# EAGLE schematic ubalancev0 (EAGLE 7.1.0)
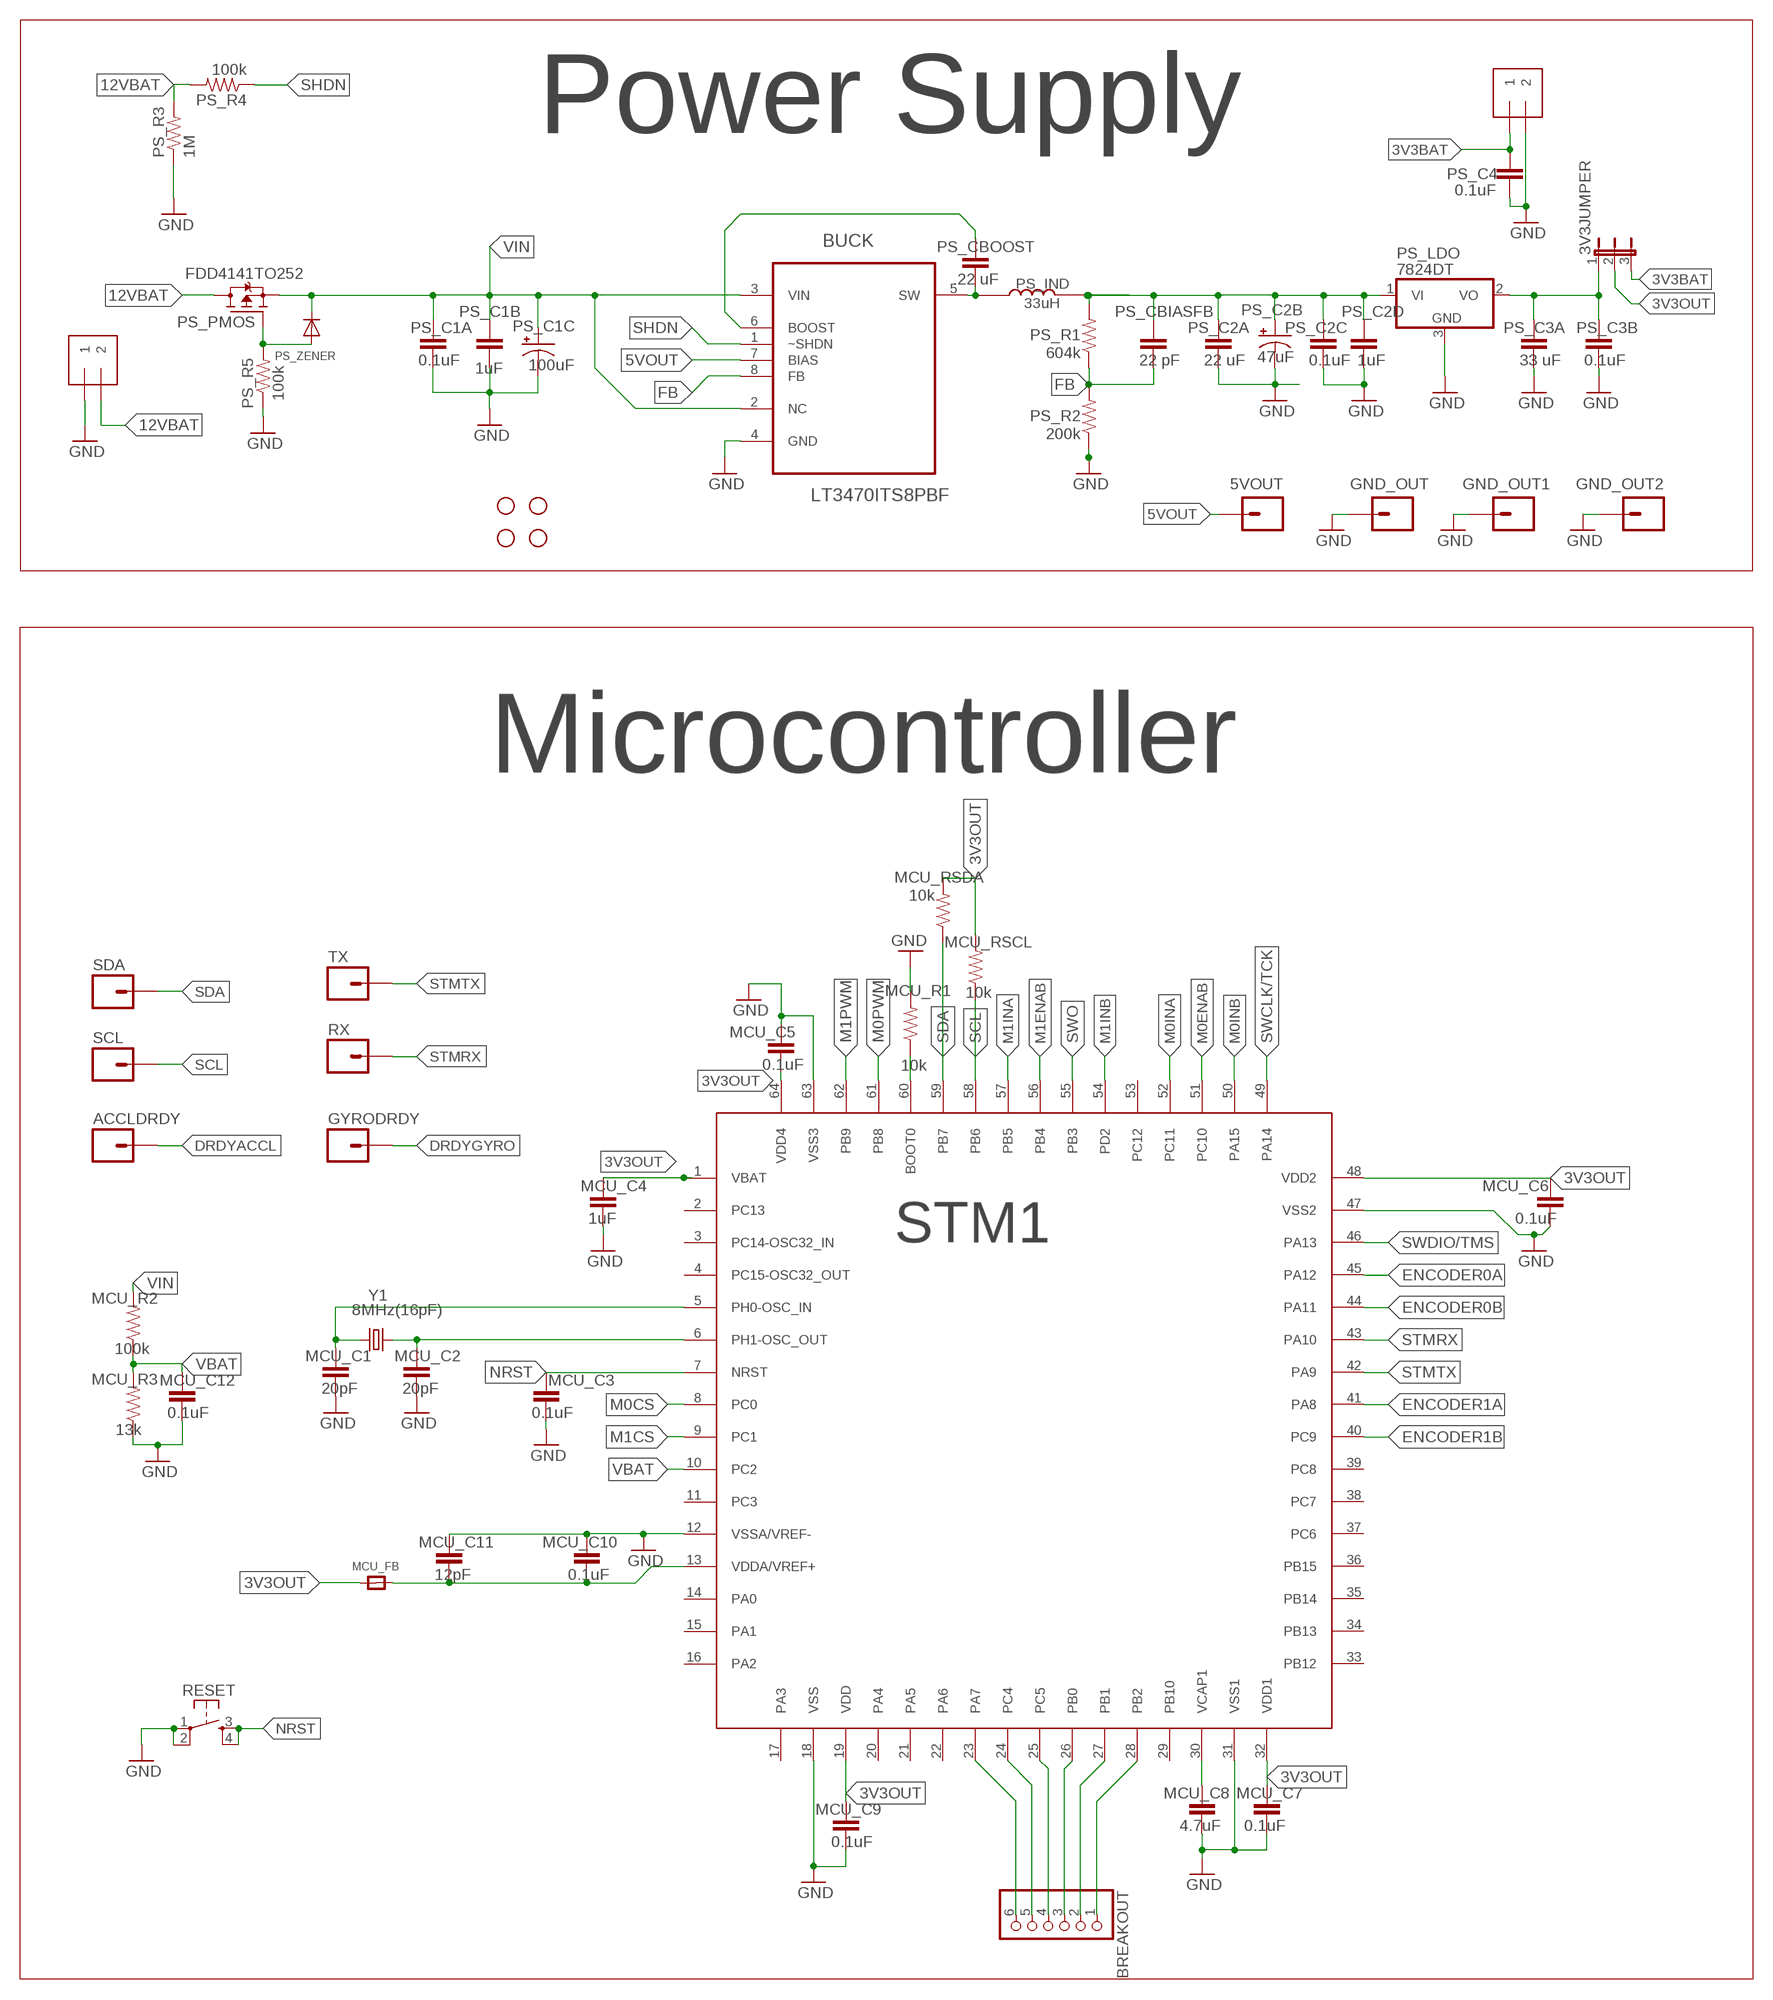
[diagram p0: schematic, sheet 1, part 1 of 2]
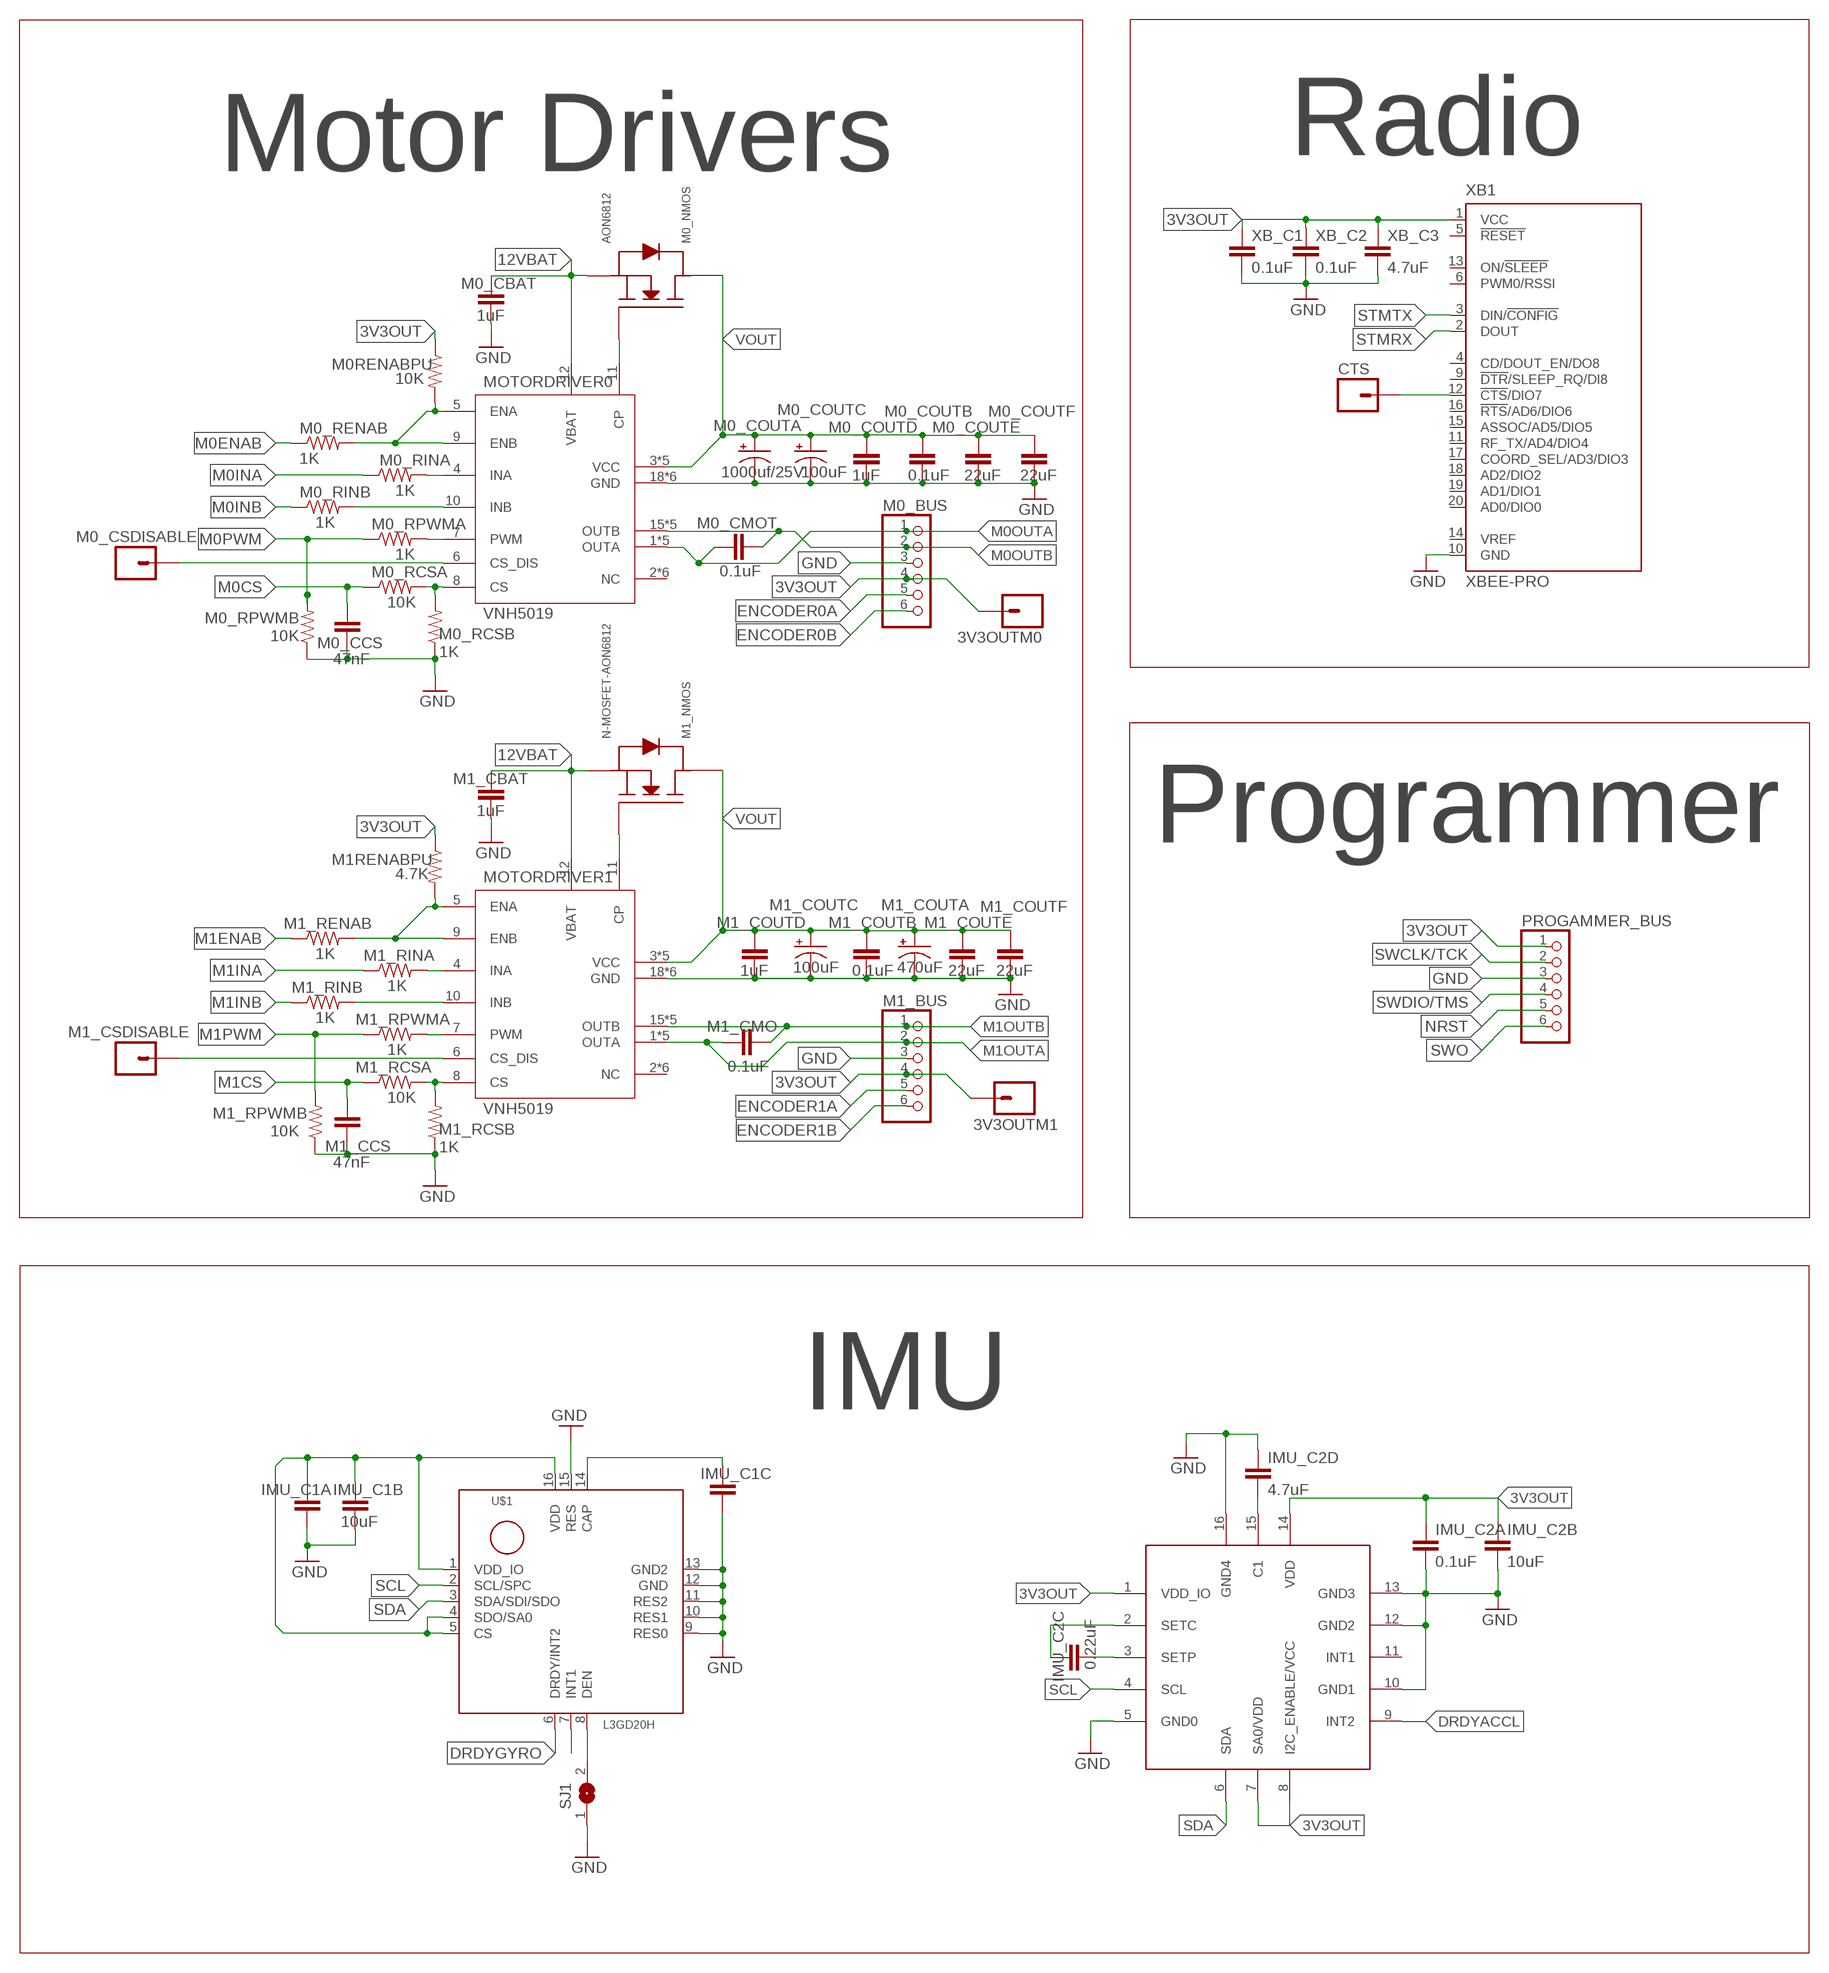
[diagram p1: schematic, sheet 1, part 2 of 2]

## Parts
3V3JUMPER  JUMPER3  [JUMPER3]
3V3OUTM0  M01PTH  [1X01]
3V3OUTM1  M01PTH  [1X01]
5VOUT  M01PTH  [1X01]
ACCLDRDY  M01PTH  [1X01]
BREAKOUT  PINHD-1X6LOCK  [1X06-BIGLOCK]
BUCK  LT3470ITS8PBF  [SOT65P280X100-8N]
CTS  M01PTH  [1X01]
GND_OUT  M01PTH  [1X01]
GND_OUT1  M01PTH  [1X01]
GND_OUT2  M01PTH  [1X01]
GYRODRDY  M01PTH  [1X01]
IMU_C1A  0.1uF  CAP0805  [0805]
IMU_C1B  10uF  CAP0805  [0805]
IMU_C1C  10nF  CAP0805  [0805]
IMU_C2A  0.1uF  CAP0805  [0805]
IMU_C2B  10uF  CAP0805  [0805]
IMU_C2C  0.22uF  CAP0805  [0805]
IMU_C2D  4.7uF  CAP0805  [0805]
M0_BUS  PINHD-1X6LOCK  [1X06-BIGLOCK]
M0_CBAT  1uF  CAP0805  [0805]
M0_CCS  47nF  CAP0805  [0805]
M0_CMOT  0.1uF  CAP0805  [0805]
M0_COUTA  1000uf/25V  1000UF-25V(PTH)KIT  [CPOL-RADIAL-1000UF-25V-KIT]
M0_COUTB  0.1uF  CAP0805  [0805]
M0_COUTC  100uF  CAP_POLD  [PANASONIC_D]
M0_COUTD  1uF  CAP0805  [0805]
M0_COUTE  22uF  CAP1206  [1206]
M0_COUTF  22uF  CAP0805  [0805]
M0_CSDISABLE  M01PTH  [1X01]
M0_NMOS  AON6812  N-MOSFET-AON6812  [8DFN-5*6MM]
M0_RCSA  10K  RESISTOR0805-RES  [0805]
M0_RCSB  1K  RESISTOR0805-RES  [0805]
M0_RENAB  1K  RESISTOR0805-RES  [0805]
M0_RINA  1K  RESISTOR0805-RES  [0805]
M0_RINB  1K  RESISTOR0805-RES  [0805]
M0_RPWMA  1K  RESISTOR0805-RES  [0805]
M0_RPWMB  10K  RESISTOR0805-RES  [0805]
M0RENABPU  10K  RESISTOR0805-RES  [0805]
M1_BUS  PINHD-1X6LOCK  [1X06-BIGLOCK]
M1_CBAT  1uF  CAP0805  [0805]
M1_CCS  47nF  CAP0805  [0805]
M1_CMO  0.1uF  CAP0805  [0805]
M1_COUTA  470uF  CPOL-USG  [PANASONIC_G]
M1_COUTB  0.1uF  CAP0805  [0805]
M1_COUTC  100uF  CAP_POLD  [PANASONIC_D]
M1_COUTD  1uF  CAP0805  [0805]
M1_COUTE  22uF  CAP1206  [1206]
M1_COUTF  22uF  CAP1206  [1206]
M1_CSDISABLE  M01PTH  [1X01]
M1_NMOS  N-MOSFET-AON6812  [8DFN-5*6MM]
M1_RCSA  10K  RESISTOR0805-RES  [0805]
M1_RCSB  1K  RESISTOR0805-RES  [0805]
M1_RENAB  1K  RESISTOR0805-RES  [0805]
M1_RINA  1K  RESISTOR0805-RES  [0805]
M1_RINB  1K  RESISTOR0805-RES  [0805]
M1_RPWMA  1K  RESISTOR0805-RES  [0805]
M1_RPWMB  10K  RESISTOR0805-RES  [0805]
M1RENABPU  4.7K  RESISTOR0805-RES  [0805]
MCU_C1  20pF  CAP0805  [0805]
MCU_C2  20pF  CAP0805  [0805]
MCU_C3  0.1uF  CAP0805  [0805]
MCU_C4  1uF  CAP0805  [0805]
MCU_C5  0.1uF  CAP0805  [0805]
MCU_C6  0.1uF  CAP0805  [0805]
MCU_C7  0.1uF  CAP0805  [0805]
MCU_C8  4.7uF  CAP0805  [0805]
MCU_C9  0.1uF  CAP0805  [0805]
MCU_C10  0.1uF  CAP0805  [0805]
MCU_C11  12pF  CAP0805  [0805]
MCU_C12  0.1uF  CAP0805  [0805]
MCU_FB  FERRITE  [0603]
MCU_R1  10k  RESISTOR0805-RES  [0805]
MCU_R2  100k  RESISTOR0805-RES  [0805]
MCU_R3  13k  RESISTOR0805-RES  [0805]
MCU_RSCL  10k  RESISTOR0805-RES  [0805]
MCU_RSDA  10k  RESISTOR0805-RES  [0805]
MOTORDRIVER0  VNH5019  [MULTIPOWERSO-30]
MOTORDRIVER1  VNH5019  [MULTIPOWERSO-30]
PROGAMMER_BUS  PINHD-1X6LOCK  [1X06-BIGLOCK]
PS_3V3TERM  1X2-3.5MM  [1X2-3.5MM]
PS_12VTERM  1X2-3.5MM  [1X2-3.5MM]
PS_C1A  0.1uF  CAP0805  [0805]
PS_C1B  1uF  CAP0805  [0805]
PS_C1C  100uF  CAP_POLD  [PANASONIC_D]
PS_C2A  22 uF  CAP1206  [1206]
PS_C2B  47uF  CAP_POLD  [PANASONIC_D]
PS_C2C  0.1uF  CAP0805  [0805]
PS_C2D  1uF  CAP0805  [0805]
PS_C3A  33 uF  CAP1206  [1206]
PS_C3B  0.1uF  CAP0805  [0805]
PS_C4  0.1uF  CAP0805  [0805]
PS_CBIASFB  22 pF  CAP0805  [0805]
PS_CBOOST  .22 uF  CAP0402-CAP  [0402-CAP]
PS_IND  33uH  SMDINDUCTOR  [VLCF5024]
PS_LDO  7824DT  [TO252]
PS_PMOS  FDD4141TO252  [TO252]
PS_R1  604k  RESISTOR0805-RES  [0805]
PS_R2  200k  RESISTOR0805-RES  [0805]
PS_R3  1M  RESISTOR0805-RES  [0805]
PS_R4  100k  RESISTOR0805-RES  [0805]
PS_R5  100k  RESISTOR0805-RES  [0805]
PS_ZENER  DIODESOD-123  [SOD-123]
RESET  TAC_SWITCHPTH  [TACTILE-PTH]
RX  M01PTH  [1X01]
SCL  M01PTH  [1X01]
SDA  M01PTH  [1X01]
SJ1  SOLDERJUMPER  [SOLDERJUMPER_ARROW_NOPASTE]
STANDOFF1  STAND-OFF  [STAND-OFF]
STANDOFF2  STAND-OFF  [STAND-OFF]
STANDOFF3  STAND-OFF  [STAND-OFF]
STANDOFF4  STAND-OFF  [STAND-OFF]
STM1  STM32F4  [LQFP64]
TX  M01PTH  [1X01]
U$1  L3GD20H  [LGA16_3X3MM]
U$2  LSM303D  [LGA16_3X3MM]
XB1  XBEE-PRO  [XBEE-PRO]
XB_C1  0.1uF  CAP0805  [0805]
XB_C2  0.1uF  CAP0805  [0805]
XB_C3  4.7uF  CAP0805  [0805]
Y1  8MHz(16pF)  CRYSTALHC49US  [HC49US]

## Nets
3V3BAT: 3V3JUMPER.3 PS_3V3TERM.1 PS_C4.1
3V3OUT: 3V3JUMPER.2 3V3OUTM0.1 3V3OUTM1.1 IMU_C1A.1 IMU_C1B.1 IMU_C2A.1 IMU_C2B.1 M0_BUS.4 M0RENABPU.1 M1_BUS.4 M1RENABPU.1 MCU_C4.1 MCU_C5.1 MCU_C6.2 MCU_C7.1 MCU_C9.1 MCU_FB.1 MCU_RSCL.2 MCU_RSDA.2 PROGAMMER_BUS.1 STM1.1(VBAT) STM1.19(VDD) STM1.32(VDD1) STM1.48(VDD2) STM1.64(VDD4) U$1.1(VDD_IO) U$1.4(SDO/SA0) U$1.5(CS) U$1.16(VDD) U$2.1(VDD_IO) U$2.7(SA0/VDD) U$2.8(I2C_ENABLE/VCC) U$2.14(VDD) XB1.1(VCC) XB_C1.1 XB_C2.1 XB_C3.1
3V3OUTREG: 3V3JUMPER.1 PS_C3A.1 PS_C3B.1 PS_LDO.2(VO)
5VOUT: 5VOUT.1 BUCK.7(BIAS) PS_C2A.1 PS_C2B.+ PS_C2C.1 PS_C2D.1 PS_CBIASFB.1 PS_IND.P2 PS_LDO.1(VI) PS_R1.2
12VBAT: M0_CBAT.1 M0_NMOS.S1(SOURCE) M0_NMOS.S2(SOURCE) M0_NMOS.S3(SOURCE) M1_CBAT.1 M1_NMOS.S1(SOURCE) M1_NMOS.S2(SOURCE) M1_NMOS.S3(SOURCE) MOTORDRIVER0.12(VBAT) MOTORDRIVER1.12(VBAT) PS_12VTERM.2 PS_PMOS.3(D) PS_R3.2 PS_R4.2
CAP: IMU_C1C.1 U$1.14(CAP)
DRDYACCL: ACCLDRDY.1 U$2.9(INT2)
DRDYGYRO: GYRODRDY.1 U$1.6(DRDY/INT2)
ENCODER0A: M0_BUS.5 STM1.45(PA12)
ENCODER0B: M0_BUS.6 STM1.44(PA11)
ENCODER1A: M1_BUS.5 STM1.41(PA8)
ENCODER1B: M1_BUS.6 STM1.40(PC9)
FB: BUCK.8(FB) PS_CBIASFB.2 PS_R1.1 PS_R2.2
GND: BUCK.4(GND) GND_OUT1.1 GND_OUT2.1 GND_OUT.1 IMU_C1A.2 IMU_C1B.2 IMU_C1C.2 IMU_C2A.2 IMU_C2B.2 IMU_C2D.1 M0_BUS.3 M0_CBAT.2 M0_CCS.2 M0_COUTA.- M0_COUTB.2 M0_COUTC.- M0_COUTD.2 M0_COUTE.2 M0_COUTF.2 M0_RCSB.1 M0_RPWMB.1 M1_BUS.3 M1_CBAT.2 M1_CCS.2 M1_COUTA.- M1_COUTB.2 M1_COUTC.- M1_COUTD.2 M1_COUTE.2 M1_COUTF.2 M1_RCSB.1 M1_RPWMB.1 MCU_C1.2 MCU_C2.2 MCU_C3.2 MCU_C4.2 MCU_C5.2 MCU_C6.1 MCU_C7.2 MCU_C8.2 MCU_C9.2 MCU_C10.2 MCU_C11.1 MCU_C12.2 MCU_R1.2 MCU_R3.1 MOTORDRIVER0.18(GND) MOTORDRIVER0.19(GND) MOTORDRIVER0.20(GND) MOTORDRIVER0.26(GND) MOTORDRIVER0.27(GND) MOTORDRIVER0.28(GND) MOTORDRIVER1.18(GND) MOTORDRIVER1.19(GND) MOTORDRIVER1.20(GND) MOTORDRIVER1.26(GND) MOTORDRIVER1.27(GND) MOTORDRIVER1.28(GND) PROGAMMER_BUS.3 PS_3V3TERM.2 PS_12VTERM.1 PS_C1A.2 PS_C1B.2 PS_C1C.- PS_C2A.2 PS_C2B.- PS_C2C.2 PS_C2D.2 PS_C3A.2 PS_C3B.2 PS_C4.2 PS_LDO.3(GND) PS_R2.1 PS_R3.1 PS_R5.1 RESET.1 RESET.2 SJ1.1 STM1.12(VSSA/VREF-) STM1.18(VSS) STM1.31(VSS1) STM1.47(VSS2) STM1.63(VSS3) U$1.9(RES0) U$1.10(RES1) U$1.11(RES2) U$1.12(GND) U$1.13(GND2) U$1.15(RES) U$2.5(GND0) U$2.10(GND1) U$2.12(GND2) U$2.13(GND3) U$2.16(GND4) XB1.10(GND) XB_C1.2 XB_C2.2 XB_C3.2
M0CS: M0_CCS.1 M0_RCSA.1 STM1.8(PC0)
M0ENAB: M0_RENAB.1 STM1.51(PC10)
M0INA: M0_RINA.1 STM1.52(PC11)
M0INB: M0_RINB.1 STM1.50(PA15)
M0OUTA: M0_BUS.1 M0_CMOT.1 MOTORDRIVER0.1(OUTA) MOTORDRIVER0.25(OUTA) MOTORDRIVER0.30(OUTA) MOTORDRIVER0.OUTA MOTORDRIVER0.OUTA@1(OUTA)
M0OUTB: M0_BUS.2 M0_CMOT.2 MOTORDRIVER0.15(OUTB) MOTORDRIVER0.16(OUTB) MOTORDRIVER0.21(OUTB) MOTORDRIVER0.OUTB MOTORDRIVER0.OUTB@1(OUTB)
M0PWM: M0_RPWMA.1 M0_RPWMB.2 STM1.61(PB8)
M1CS: M1_CCS.1 M1_RCSA.1 STM1.9(PC1)
M1ENAB: M1_RENAB.1 STM1.56(PB4)
M1INA: M1_RINA.1 STM1.57(PB5)
M1INB: M1_RINB.1 STM1.54(PD2)
M1OUTA: M1_BUS.2 M1_CMO.1 MOTORDRIVER1.1(OUTA) MOTORDRIVER1.25(OUTA) MOTORDRIVER1.30(OUTA) MOTORDRIVER1.OUTA MOTORDRIVER1.OUTA@1(OUTA)
M1OUTB: M1_BUS.1 M1_CMO.2 MOTORDRIVER1.15(OUTB) MOTORDRIVER1.16(OUTB) MOTORDRIVER1.21(OUTB) MOTORDRIVER1.OUTB MOTORDRIVER1.OUTB@1(OUTB)
M1PWM: M1_RPWMA.1 M1_RPWMB.2 STM1.62(PB9)
N$2: M1_NMOS.G(GATE) MOTORDRIVER1.11(CP)
N$4: BUCK.6(BOOST) PS_CBOOST.1
N$6: M0_NMOS.G(GATE) MOTORDRIVER0.11(CP)
N$8: IMU_C2C.1 U$2.3(SETP)
N$9: BREAKOUT.6 STM1.23(PA7)
N$10: M0_RENAB.2 M0RENABPU.2 MOTORDRIVER0.5(ENA) MOTORDRIVER0.9(ENB)
N$11: MCU_C10.1 MCU_C11.2 MCU_FB.2 STM1.13(VDDA/VREF+)
N$12: BREAKOUT.5 STM1.24(PC4)
N$13: M0_RINA.2 MOTORDRIVER0.4(INA)
N$14: M0_RINB.2 MOTORDRIVER0.10(INB)
N$15: M0_RPWMA.2 MOTORDRIVER0.7(PWM)
N$16: M0_CSDISABLE.1 MOTORDRIVER0.6(CS_DIS)
N$17: M0_RCSA.2 M0_RCSB.2 MOTORDRIVER0.8(CS)
N$18: MCU_C8.1 STM1.30(VCAP1)
N$19: MCU_R1.1 STM1.60(BOOT0)
N$20: IMU_C2D.2 U$2.15(C1)
N$22: IMU_C2C.2 U$2.2(SETC)
N$23: BREAKOUT.4 STM1.25(PC5)
N$24: M1_RENAB.2 M1RENABPU.2 MOTORDRIVER1.5(ENA) MOTORDRIVER1.9(ENB)
N$25: M1_RINA.2 MOTORDRIVER1.4(INA)
N$26: M1_RINB.2 MOTORDRIVER1.10(INB)
N$27: M1_RPWMA.2 MOTORDRIVER1.7(PWM)
N$28: M1_CSDISABLE.1 MOTORDRIVER1.6(CS_DIS)
N$29: M1_RCSA.2 M1_RCSB.2 MOTORDRIVER1.8(CS)
N$31: BREAKOUT.3 STM1.26(PB0)
N$32: MCU_C1.1 STM1.5(PH0-OSC_IN) Y1.1
N$34: MCU_C2.1 STM1.6(PH1-OSC_OUT) Y1.2
N$35: BREAKOUT.2 STM1.27(PB1)
N$36: BREAKOUT.1 STM1.28(PB2)
N$37: SJ1.2 U$1.8(DEN)
N$40: CTS.1 XB1.12(!CTS!/DIO7)
N$41: U$1.7(INT1)
NRST: MCU_C3.1 PROGAMMER_BUS.5 RESET.3 RESET.4 STM1.7(NRST)
PMOSGATE: PS_PMOS.1(G) PS_R5.2 PS_ZENER.A
SCL: MCU_RSCL.1 SCL.1 STM1.58(PB6) U$1.2(SCL/SPC) U$2.4(SCL)
SDA: MCU_RSDA.1 SDA.1 STM1.59(PB7) U$1.3(SDA/SDI/SDO) U$2.6(SDA)
SHDN: BUCK.1(~SHDN) PS_R4.1
STMRX: RX.1 STM1.43(PA10) XB1.2(DOUT)
STMTX: STM1.42(PA9) TX.1 XB1.3(DIN/!CONFIG)
SW: BUCK.5(SW) PS_CBOOST.2 PS_IND.P1
SWCLK/TCK: PROGAMMER_BUS.2 STM1.49(PA14)
SWDIO/TMS: PROGAMMER_BUS.4 STM1.46(PA13)
SWO: PROGAMMER_BUS.6 STM1.55(PB3)
VBAT: MCU_C12.1 MCU_R2.1 MCU_R3.2 STM1.10(PC2)
VIN: BUCK.2(NC) BUCK.3(VIN) MCU_R2.2 PS_C1A.1 PS_C1B.1 PS_C1C.+ PS_PMOS.2(S) PS_ZENER.C
VOUT: M0_COUTA.+ M0_COUTB.1 M0_COUTC.+ M0_COUTD.1 M0_COUTE.1 M0_COUTF.1 M0_NMOS.D1(DRAIN) M0_NMOS.D2(DRAIN) M0_NMOS.D3(DRAIN) M0_NMOS.D4(DRAIN) M0_NMOS.D5(DRAIN) M1_COUTA.+ M1_COUTB.1 M1_COUTC.+ M1_COUTD.1 M1_COUTE.1 M1_COUTF.1 M1_NMOS.D1(DRAIN) M1_NMOS.D2(DRAIN) M1_NMOS.D3(DRAIN) M1_NMOS.D4(DRAIN) M1_NMOS.D5(DRAIN) MOTORDRIVER0.3(VCC) MOTORDRIVER0.13(VCC) MOTORDRIVER0.23(VCC) MOTORDRIVER0.VCC MOTORDRIVER0.VCC@1(VCC) MOTORDRIVER1.3(VCC) MOTORDRIVER1.13(VCC) MOTORDRIVER1.23(VCC) MOTORDRIVER1.VCC MOTORDRIVER1.VCC@1(VCC)
Unconnected: MOTORDRIVER0.2(NC) MOTORDRIVER0.14(NC) MOTORDRIVER0.17(NC) MOTORDRIVER0.22(NC) MOTORDRIVER0.24(NC) MOTORDRIVER0.29(NC) MOTORDRIVER1.2(NC) MOTORDRIVER1.14(NC) MOTORDRIVER1.17(NC) MOTORDRIVER1.22(NC) MOTORDRIVER1.24(NC) MOTORDRIVER1.29(NC) STM1.2(PC13) STM1.3(PC14-OSC32_IN) STM1.4(PC15-OSC32_OUT) STM1.11(PC3) STM1.14(PA0) STM1.15(PA1) STM1.16(PA2) STM1.17(PA3) STM1.20(PA4) STM1.21(PA5) STM1.22(PA6) STM1.29(PB10) STM1.33(PB12) STM1.34(PB13) STM1.35(PB14) STM1.36(PB15) STM1.37(PC6) STM1.38(PC7) STM1.39(PC8) STM1.53(PC12) U$2.11(INT1) XB1.4(CD/DOUT_EN/DO8) XB1.5(!RESET) XB1.6(PWM0/RSSI) XB1.9(!DTR!/SLEEP_RQ/DI8) XB1.11(RF_TX/AD4/DIO4) XB1.13(ON/!SLEEP) XB1.14(VREF) XB1.15(ASSOC/AD5/DIO5) XB1.16(!RTS!/AD6/DIO6) XB1.17(COORD_SEL/AD3/DIO3) XB1.18(AD2/DIO2) XB1.19(AD1/DIO1) XB1.20(AD0/DIO0)

## Notes on the sheet
- Power Supply | Radio
- Motor Drivers
- Microcontroller
- Programmer
- IMU

## Library data of the parts
3V3JUMPER = microbuilder:JUMPER3: JUMPER - 3 Pins
3V3OUTM0 3V3OUTM1 5VOUT ACCLDRDY CTS GND_OUT GND_OUT1 GND_OUT2 GYRODRDY M0_CSDISABLE M1_CSDISABLE RX SCL SDA TX = SparkFun-Connectors:M01: Header 1 Standard 1-pin 0.1" header. Use with straight break away headers (SKU : PRT-00116), right angle break away headers (PRT-00553), swiss pins (PRT-00743), machine pins (PRT-00117), and female headers (PRT-00115).
BREAKOUT M0_BUS M1_BUS PROGAMMER_BUS = Adafruit:PINHD-1X6: PIN HEADER
BUCK = LTC:LT3470ITS8PBF: Micropower Buck Regulator with Integrated Boost and Catch Diodes; MPN: LT3470ITS8#PBF; OC_FARNELL: 1531510; OC_NEWARK: 61M3375; PACKAGE: TSOT-8; SUPPLIER: Linear Technology
IMU_C1A IMU_C1B IMU_C1C IMU_C2A IMU_C2B IMU_C2C IMU_C2D M0_CBAT M0_CCS M0_CMOT M0_COUTB M0_COUTD M0_COUTE M0_COUTF M1_CBAT M1_CCS M1_CMO M1_COUTB M1_COUTD M1_COUTE M1_COUTF MCU_C1-MCU_C12 PS_C1A PS_C1B PS_C2C PS_C2D PS_C3B PS_C4 PS_CBIASFB PS_CBOOST XB_C1-XB_C3 = SparkFun-Capacitors:CAP: Capacitor Standard 0603 ceramic capacitor, and 0.1" leaded capacitor.
M0_COUTA = SparkFun-Capacitors:1000UF-25V(PTH): CAP-08070; PROD_ID: CAP-09538
M0_COUTC M1_COUTC PS_C1C PS_C2B = SparkFun-Passives:CAP_POL: Capacitor Polarized These are standard SMD and PTH capacitors. Normally 10uF, 47uF, and 100uF in electrolytic and tantalum varieties. Always verify the external diameter of the through hole cap, it varies with capacity, voltage, and manufacturer. The EIA devices should be standard.
M0_NMOS M1_NMOS = FishCustom3:N-MOSFET-AON6812
M0_RCSA M0_RCSB M0_RENAB M0_RINA M0_RINB M0_RPWMA M0_RPWMB M0RENABPU M1_RCSA M1_RCSB M1_RENAB M1_RINA M1_RINB M1_RPWMA M1_RPWMB M1RENABPU MCU_R1-MCU_R3 MCU_RSCL MCU_RSDA PS_R1-PS_R5 = SparkFun-Resistors:RESISTOR: Resistor Basic schematic elements and footprints for 0603, 1206, and PTH resistors.
M1_COUTA = rcl:CPOL-US: POLARIZED CAPACITOR, American symbol
MCU_FB = microbuilder:FERRITE: Ferrite Bead 0603 MMZ1608B121C - 120 Ohm @ 100MHz, 600mA, 0.15 Ohm DC Resistance - Digikey: 445-2164-1-ND BK1608HW121-T - 120 Ohm, 600mA Ferrite Chip - Digikey: 587-1876-2-ND 0805 HZ0805B272R-10 - 2.7K Ohm @ 100MHz, 200mA, 0.8 Ohm DC Resistance - Digikey: 240-2504-1-ND (see also Murata BLM21BD272SN1L) MMZ2012Y152B - 1.5K Ohm @ 100MHz, 500mA, 0.4 Ohm DC Resistance - Digikey: 445-1560-1-ND - Mainly for high frequency (80-400MHz) MMZ2012R102A - 1K Ohm @ 100MHz, 500mA, 0.3 Ohm DC Resistance - Digikey: 445-1555-2-ND - More general purpose (10-200MHz)
MOTORDRIVER0 MOTORDRIVER1 = Wicker:VNH5019
PS_3V3TERM PS_12VTERM = Adafruit:1X2: 3.5mm Terminal block http://www.ladyada.net/library/pcb/eaglelibrary.html
PS_C2A PS_C3A = SparkFun-Passives:CAP: Capacitor Standard 0603 ceramic capacitor, and 0.1" leaded capacitor.
PS_IND = SPInductor:SMDINDUCTOR
PS_LDO = Adafruit:78*: Positive VOLTAGE REGULATOR Added bigger pads to the TO-92 package
PS_PMOS = transistor-fet:FDD4141: P-Channel PowerTrench® MOSFET Source: FDD4141.pdf
PS_ZENER = Adafruit:DIODE: Diode SMADIODE - SMA Surface Mount Package 20V 1A Schottky Diode Digikey: 641-1014-6-ND DO-1N4148 - Through Hole Small Current Diode SOD-123 20V 1 A (.5mV Vf) Schottky Diode - Digikey: MBRX120TPMSCT-ND SOD-323 10V 570mA (.38mV Vf, 3ns) Schottky Diode - Digikey: ZLLS410CT-ND SOD-523 30V 30mA Schottky Diode (RB751S-40TE61) - Digikey: RB751S-40TE61CT-ND SOT23-R/W - SOT23 Package (R = Solder Paste/Reflow Ovens, W = Hand-Soldering) BAT54Film 40V 300mA - Digikey: 497-7162-1-ND
RESET = SparkFun-Electromechanical:TAC_SWITCH: Momentary Switch Button commonly used for reset or general input. Spark Fun Electronics SKU : COM-00097 SMT- SWCH-08247
SJ1 = microbuilder:SOLDERJUMPER: SMD Solder JUMPER Solder the two pads together to create a connection, or remove the solder to break it. REFLOW - Use this footprint for solder paste and reflow ovens. WAVE - Use this footprint for hand-soldering (larger pads). CLOSED - Has a trace between the two pads to ensure it is closed by default. The trace needs to be cut to disable the jumper, and can be closed again by creating a solder bridge between the two pads.; BOM: EXCLUDE
STANDOFF1-STANDOFF4 = SparkFun-Electromechanical:STAND-OFF: #4 Stand Off This is the mechanical footprint for a #4 phillips button head screw. Use the keepout ring to avoid running the screw head into surrounding components. SKU : PRT-00447
STM1 = STM32F4:STM32F4
U$1 = microbuilder:L3GD20H
U$2 = lga:LSM303D
XB1 = maxstream:XBEE: XBee (TM) /XBee-PRO(TM) OEM RF Modules Source: MaxStream, Inc. xbee_productmanual.pdf; MPN: XBP24-AWI-001; OC_FARNELL: 1337916; OC_NEWARK: 42M2667
Y1 = SparkFun-FreqCtrl:CRYSTAL: Various standard crystals. Proven footprints. Spark Fun Electronics SKU : COM-00534